# EAGLE design balancing_robot_h_bridges_power_sup (EAGLE 7.4.0)
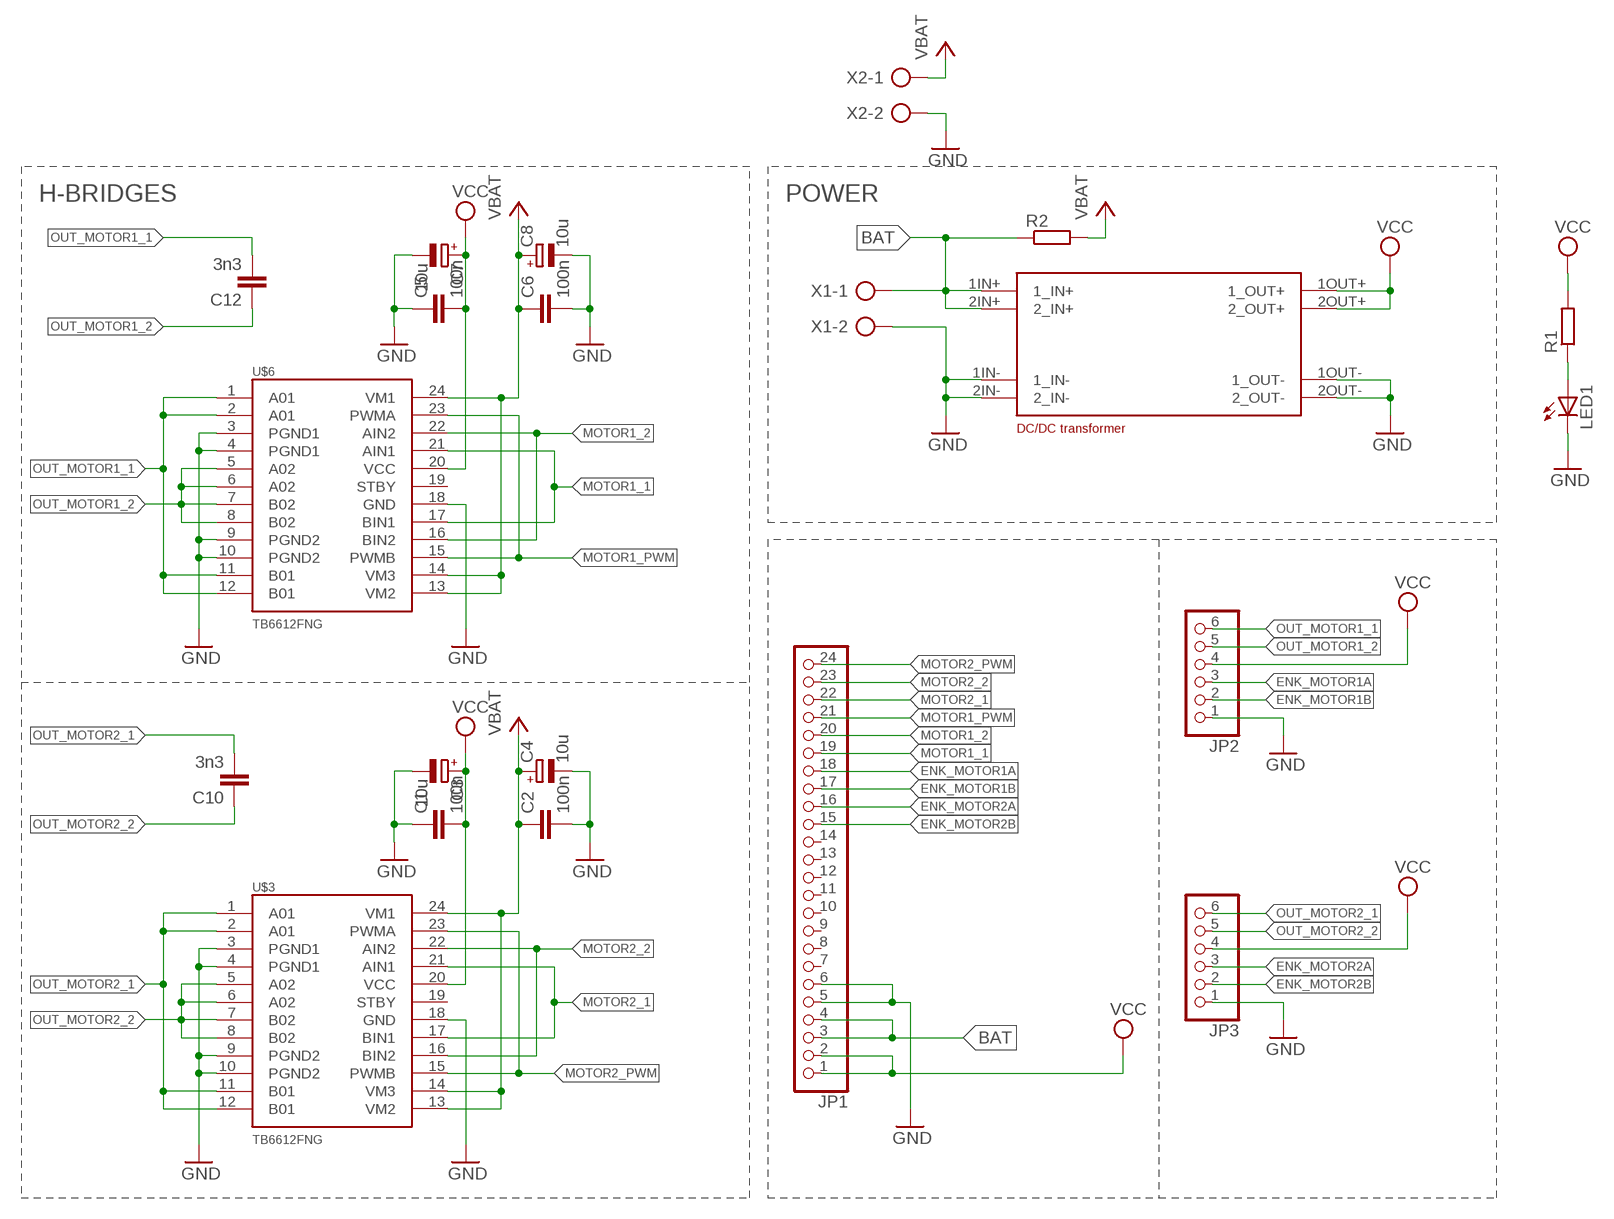
[diagram p0: schematic, sheet 1]

## Parts
C1  100n  C-EUC0603  [C0603]
C2  100n  C-EUC0603  [C0603]
C3  10u  CPOL-EU153CLV-0405  [153CLV-0405]
C4  10u  CPOL-EU153CLV-0405  [153CLV-0405]
C5  100n  C-EUC0603  [C0603]
C6  100n  C-EUC0603  [C0603]
C7  10u  CPOL-EU153CLV-0405  [153CLV-0405]
C8  10u  CPOL-EU153CLV-0405  [153CLV-0405]
C10  3n3  C-EUC0603  [C0603]
C12  3n3  C-EUC0603  [C0603]
JP1  PINHD-1X24  [1X24]
JP2  PINHD-1X6  [1X06]
JP3  PINHD-1X6  [1X06]
LED1  LEDCHIP-LED0603  [CHIP-LED0603]
R1  R-EU_R0603  [R0603]
R2  R-EU_R0805  [R0805]
U$3  TB6612FNG  [SSOP24]
U$4  TRANSFORMER  [TRANSFORMER]
U$6  TB6612FNG  [SSOP24]
X1  AK500/2  [AK500/2]
X2  AK500/2  [AK500/2]

## Nets
BAT: JP1.3 JP1.4 R2.1 U$4.1IN+(1_IN+) U$4.2IN+(2_IN+) X1.1
ENK_MOTOR1A: JP1.18 JP2.3
ENK_MOTOR1B: JP1.17 JP2.2
ENK_MOTOR2A: JP1.16 JP3.3
ENK_MOTOR2B: JP1.15 JP3.2
GND: C1.1 C2.2 C3.- C4.- C5.1 C6.2 C7.- C8.- JP1.5 JP1.6 JP2.1 JP3.1 LED1.C U$3.3(PGND1) U$3.4(PGND1) U$3.9(PGND2) U$3.10(PGND2) U$3.18(GND) U$4.1IN-(1_IN-) U$4.1OUT-(1_OUT-) U$4.2IN-(2_IN-) U$4.2OUT-(2_OUT-) U$6.3(PGND1) U$6.4(PGND1) U$6.9(PGND2) U$6.10(PGND2) U$6.18(GND) X1.2 X2.2
MOTOR1_1: JP1.19 U$6.17(BIN1) U$6.21(AIN1)
MOTOR1_2: JP1.20 U$6.16(BIN2) U$6.22(AIN2)
MOTOR1_PWM: JP1.21 U$6.15(PWMB) U$6.23(PWMA)
MOTOR2_1: JP1.22 U$3.17(BIN1) U$3.21(AIN1)
MOTOR2_2: JP1.23 U$3.16(BIN2) U$3.22(AIN2)
MOTOR2_PWM: JP1.24 U$3.15(PWMB) U$3.23(PWMA)
N$38: LED1.A R1.1
OUT_MOTOR1_1: C12.2 JP2.6 U$6.1(A01) U$6.2(A01) U$6.11(B01) U$6.12(B01)
OUT_MOTOR1_2: C12.1 JP2.5 U$6.5(A02) U$6.6(A02) U$6.7(B02) U$6.8(B02)
OUT_MOTOR2_1: C10.2 JP3.6 U$3.1(A01) U$3.2(A01) U$3.11(B01) U$3.12(B01)
OUT_MOTOR2_2: C10.1 JP3.5 U$3.5(A02) U$3.6(A02) U$3.7(B02) U$3.8(B02)
VCC: C1.2 C2.1 C3.+ C4.+ C5.2 C6.1 C7.+ C8.+ JP1.1 JP1.2 JP2.4 JP3.4 R1.2 R2.2 U$3.13(VM2) U$3.14(VM3) U$3.20(VCC) U$3.24(VM1) U$4.1OUT+(1_OUT+) U$4.2OUT+(2_OUT+) U$6.13(VM2) U$6.14(VM3) U$6.20(VCC) U$6.24(VM1) X2.1 ; supply symbol labelled VBAT
Unconnected: JP1.7 JP1.8 JP1.9 JP1.10 JP1.11 JP1.12 JP1.13 JP1.14 U$3.19(STBY) U$6.19(STBY)

## Notes on the sheet
- H-BRIDGES | POWER

## Library data of the parts
C1 C2 C5 C6 C10 C12 = rcl:C-EU: CAPACITOR, European symbol
C3 C4 C7 C8 = rcl:CPOL-EU: POLARIZED CAPACITOR, European symbol
JP1 = pinhead:PINHD-1X24: PIN HEADER
JP2 JP3 = pinhead:PINHD-1X6: PIN HEADER
LED1 = led:LED: LED OSRAM: - CHIPLED LG R971, LG N971, LY N971, LG Q971, LY Q971, LO R971, LY R971 LH N974, LH R974 LS Q976, LO Q976, LY Q976 LO Q996 - Hyper CHIPLED LW Q18S LB Q993, LB Q99A, LB R99A - SideLED LS A670, LO A670, LY A670, LG A670, LP A670 LB A673, LV A673, LT A673, LW A673 LH A674 LY A675 LS A676, LA A676, LO A676, LY A676, LW A676 LS A679, LY A679, LG A679 - Hyper Micro SIDELED® LS Y876, LA Y876, LO Y876, LY Y876 LT Y87S - SmartLED LW L88C, LW L88S LB L89C, LB L89S, LG L890 LS L89K, LO L89K, LY L89K LS L896, LA L896, LO L896, LY L896 - TOPLED LS T670, LO T670, LY T670, LG T670, LP T670 LSG T670, LSP T670, LSY T670, LOP T670, LYG T670 LG T671, LOG T671, LSG T671 LB T673, LV T673, LT T673, LW T673 LH T674 LS T676, LA T676, LO T676, LY T676, LB T676, LH T676, LSB T676, LW T676 LB T67C, LV T67C, LT T67C, LS T67K, LO T67K, LY T67K, LW E67C LS E67B, LA E67B, LO E67B, LY E67B, LB E67C, LV E67C, LT E67C LW T67C LS T679, LY T679, LG T679 LS T770, LO T770, LY T770, LG T770, LP T770 LB T773, LV T773, LT T773, LW T773 LH T774 LS E675, LA E675, LY E675, LS T675 LS T776, LA T776, LO T776, LY T776, LB T776 LHGB T686 LT T68C, LB T68C - Hyper Mini TOPLED® LB M676 - Mini TOPLED Santana® LG M470 LS M47K, LO M47K, LY M47K Source: http://www.osram.convergy.de LUXEON: - LUMILED® LXK2-PW12-R00, LXK2-PW12-S00, LXK2-PW14-U00, LXK2-PW14-V00 LXK2-PM12-R00, LXK2-PM12-S00, LXK2-PM14-U00 LXK2-PE12-Q00, LXK2-PE12-R00, LXK2-PE12-S00, LXK2-PE14-T00, LXK2-PE14-U00 LXK2-PB12-K00, LXK2-PB12-L00, LXK2-PB12-M00, LXK2-PB14-N00, LXK2-PB14-P00, LXK2-PB14-Q00 LXK2-PR12-L00, LXK2-PR12-M00, LXK2-PR14-Q00, LXK2-PR14-R00 LXK2-PD12-Q00, LXK2-PD12-R00, LXK2-PD12-S00 LXK2-PH12-R00, LXK2-PH12-S00 LXK2-PL12-P00, LXK2-PL12-Q00, LXK2-PL12-R00 Source: www.luxeon.com KINGBRIGHT: KA-3528ASYC Source: www.kingbright.com
R1 R2 = rcl:R-EU_: RESISTOR, European symbol
U$3 U$6 = SparkFun-PowerIC:TB6612FNG: Toshiba 1A dual motor driver IC-09363; PROD_ID: IC-09363
U$4 = DC_DC_transformer:TRANSFORMER
X1 X2 = con-ptr500:AK500/2: CONNECTOR; OC_FARNELL: unknown; OC_NEWARK: unknown

## Board
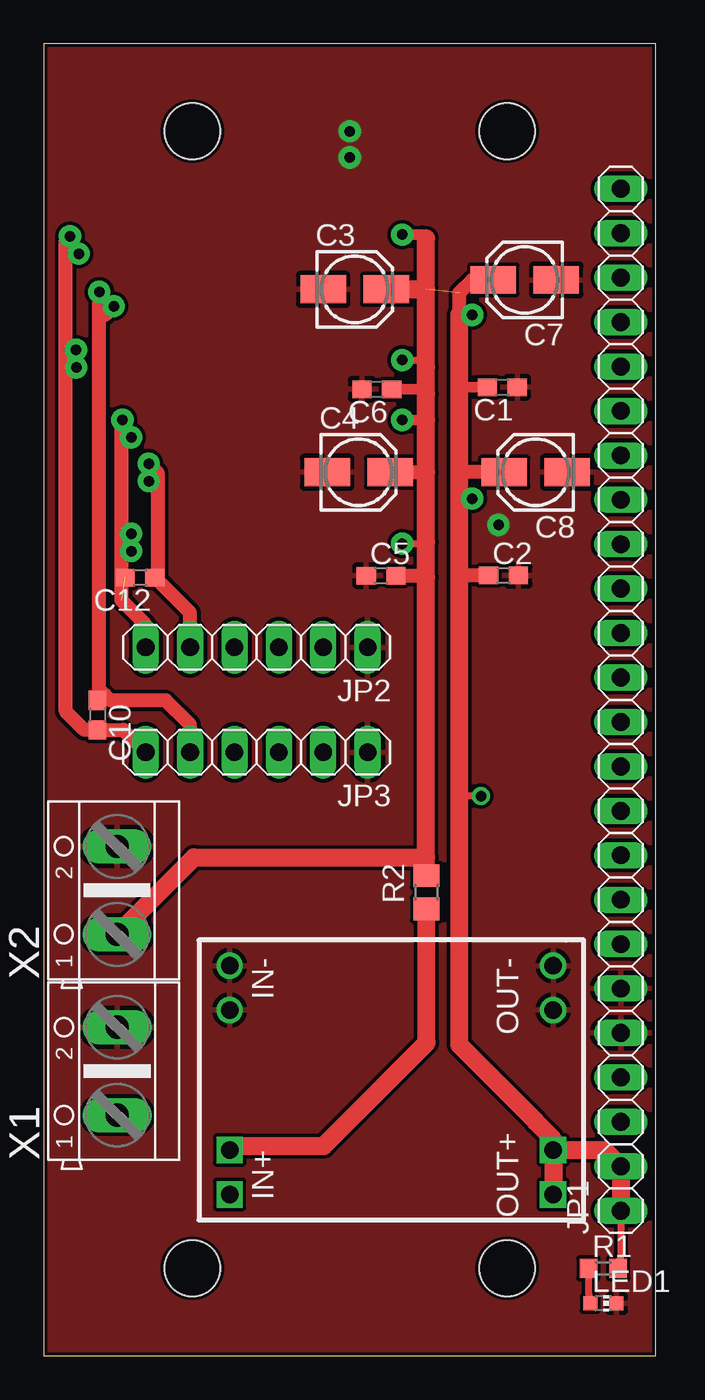
[diagram p1: board, top side]
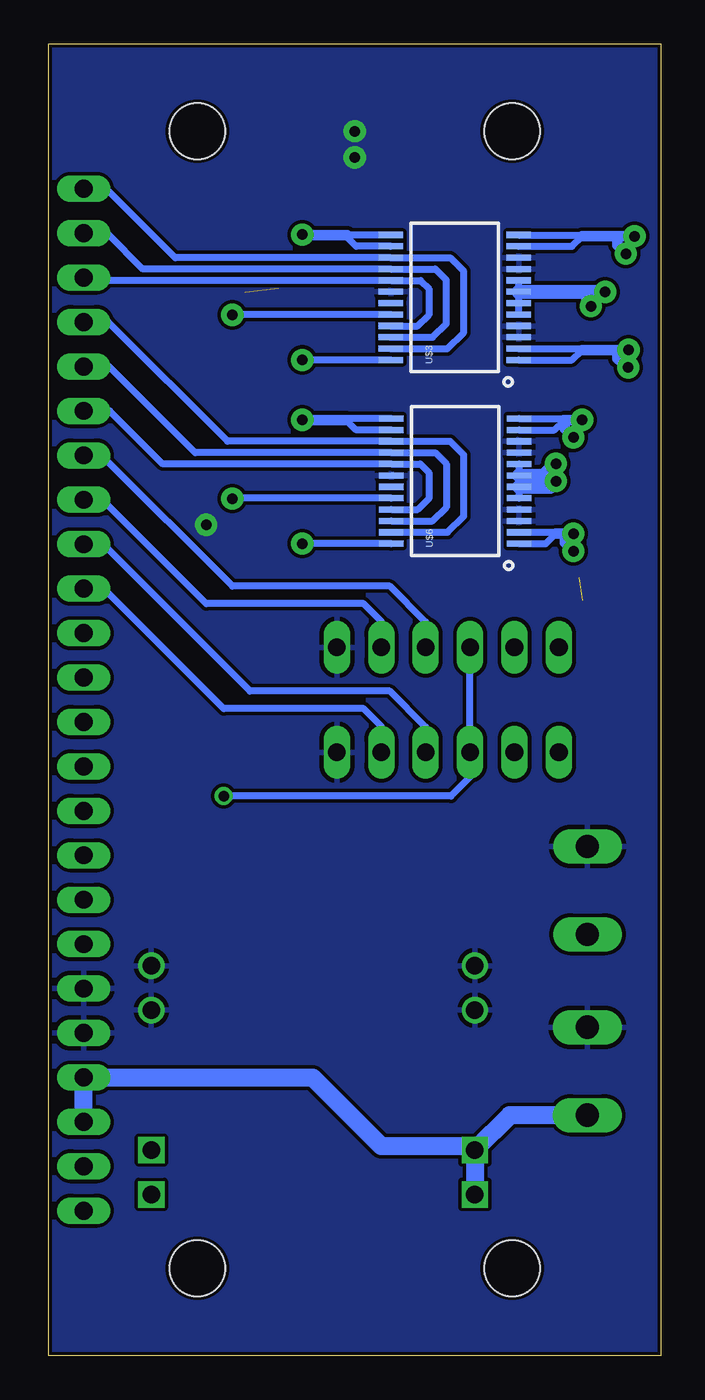
[diagram p2: board, bottom side, seen from below]

Size 35 x 75 mm. Coordinates in mm from the lower left corner, seen from the top.
Outline: 0,0 35,0 35,75 0,75 0,0
Copper layers (1*16): Top 0.035mm / dielectric 1.5mm / Bottom 0.035mm
Design rules "default *": minimum track width 10mil, minimum drill 0.5mm, track to track 8mil, track to pad 8mil, pad to pad 8mil, via to via 8mil, smd to smd 8mil, copper to edge 8mil, drill to drill 8mil, minimum pad ring 10mil, minimum via ring 8mil, stop-mask expansion 4mil, vias tented up to drill 0mil, thermal gap 10mil
Holes 3.2 mm at 8.5,5 26.5,5 8.5,70 26.5,70

### Footprints (pad centres in the part's own frame; a part is rotated, then mirrored left to right if it is on the bottom)
C0603 = smd 1.1 x 1: 1 -0.85,0; 2 0.85,0
153CLV-0405 = smd 2.6 x 1.6: + 1.8,0; - -1.8,0
1X24 = drill 1.016 long: 1 -29.21,0; 2 -26.67,0; 3 -24.13,0; 4 -21.59,0; 5 -19.05,0; 6 -16.51,0; 7 -13.97,0; 8 -11.43,0; 9 -8.89,0; 10 -6.35,0; 11 -3.81,0; 12 -1.27,0; 13 1.27,0; 14 3.81,0; 15 6.35,0; 16 8.89,0; 17 11.43,0; 18 13.97,0; 19 16.51,0; 20 19.05,0; 21 21.59,0; 22 24.13,0; 23 26.67,0; 24 29.21,0
1X06 = drill 1.016 long: 1 -6.35,0; 2 -3.81,0; 3 -1.27,0; 4 1.27,0; 5 3.81,0; 6 6.35,0
CHIP-LED0603 = smd 0.8 x 0.8: A 0,-0.75; C 0,0.75
R0603 = smd 1 x 1.1: 1 -0.85,0; 2 0.85,0
R0805 = smd 1.3 x 1.5: 1 -0.95,0; 2 0.95,0
SSOP24 = smd 0.348 x 1.397: 1 -3.575,-3.656; 2 -2.925,-3.656; 3 -2.275,-3.656; 4 -1.625,-3.656; 5 -0.975,-3.656; 6 -0.325,-3.656; 7 0.325,-3.656; 8 0.975,-3.656; 9 1.625,-3.656; 10 2.275,-3.656; 11 2.925,-3.656; 12 3.575,-3.656; 13 3.575,3.656; 14 2.925,3.656; 15 2.275,3.656; 16 1.625,3.656; 17 0.975,3.656; 18 0.325,3.656; 19 -0.325,3.656; 20 -0.975,3.656; 21 -1.625,3.656; 22 -2.275,3.656; 23 -2.925,3.656; 24 -3.575,3.656
TRANSFORMER = drill 1 square: 1IN+ 4,-9.25; 1OUT+ 4,9.25; 2IN+ 6.54,-9.25; 2OUT+ 6.54,9.25 | drill 1: 1IN- -6.54,-9.25; 1OUT- -6.54,9.25; 2IN- -4,-9.25; 2OUT- -4,9.25
AK500/2 = drill 1.321 long: 1 -2.515,0; 2 2.515,0

### Placement (x,y rotation side)
C1  26.23,55.36 180 top
C2  26.29,44.61 0 top
C3  17.78,60.96 0 top
C4  18,50.5 0 top
C5  19.29,44.6 0 top
C6  19.05,55.24 180 top
C7  27.5,61.5 180 top
C8  28.13,50.51 180 top
C10  3.08,36.62 270 top
C12  5.51,44.48 180 top
JP1  33,37.5 90 top
JP2  12.18,40.5 180 top
JP3  12.18,34.5 180 top
LED1  32,3 270 top
R1  32,5 0 top
R2  21.89,26.5 90 top
U$3  11.78,60.49 90 bottom
U$4  19.88,15.76 270 top
U$6  11.76,50 90 bottom
X1  4.2,16.27 90 top
X2  4.19,26.61 90 top

### Tracks (layer width: path | path; a pad name or v marks a point on that pad's centre or on a via)
BAT
  Top 1.016: U$4.1IN+ 10.87,12 16,12 21.89,17.89 R2.1
  Bottom 1.016: X1.1 8.63,13.76 U$4.1IN+ | U$4.1IN+ U$4.2IN+ | JP1.3 JP1.4 19.91,15.91 16,12 10.87,12 U$4.1IN+
ENK_MOTOR1A
  Bottom 0.406: JP2.3 13.45,41.95 15.5,44 24.5,44 31.97,51.47 JP1.18
ENK_MOTOR1B
  Bottom 0.406: JP2.2 15.98,41.98 17,43 26,43 31.93,48.93 JP1.17
ENK_MOTOR2A
  Bottom 0.406: JP3.3 13.45,35.95 15.5,38 23.5,38 31.89,46.39 JP1.16
ENK_MOTOR2B
  Bottom 0.406: JP3.2 15.98,35.98 17,37 25,37 31.85,43.85 JP1.15
GND  (via drill 0.6 pad 1.27)
  other vias: 17.5,70 17.5,68.5 26,47.5
  pour Top: -1.27,76.83 36.2,76.83 36.2,-3.17 -1.27,-3.17
  pour Bottom: -0.64,76.2 35.56,76.2 35.56,-2.54 -0.64,-2.54
MOTOR1_1
  Bottom 0.406: U$6.21 13.9,48.37 13.27,49 13.27,50.5 13.74,50.97 U$6.17 28.47,50.97 31.51,54.01 JP1.19
MOTOR1_2
  Bottom 0.406: U$6.22 13.05,47.72 12.27,48.5 12.27,51 12.89,51.62 U$6.16 26.62,51.62 31.55,56.55 JP1.20
MOTOR1_PWM
  Bottom 0.406: U$6.23 12.2,47.07 11.27,48 11.27,51.5 12.04,52.27 U$6.15 24.77,52.27 31.59,59.09 JP1.21
MOTOR2_1
  Bottom 0.406: U$3.21 13.9,58.87 13.27,59.5 13.27,61 13.74,61.47 U$3.17 32.84,61.47 JP1.22
MOTOR2_2
  Bottom 0.406: U$3.22 13.05,58.22 12.27,59 12.27,61.5 12.89,62.12 U$3.16 29.62,62.12 31.67,64.17 JP1.23
MOTOR2_PWM
  Bottom 0.406: U$3.23 12.2,57.57 11.27,58.5 11.27,62 12.04,62.77 U$3.15 27.77,62.77 28,63 28.25,63.25 31.71,66.71 JP1.24
N$38
  Top 0.406: R1.1 31.15,3.6 LED1.A
OUT_MOTOR1_1  (via drill 0.6 pad 1.27)  (1 unrouted)
  Top 0.61: v5,47 4.45,47 | v5,46 4.5,46 | v5,52.5 4.5,52.5
  Top 0.813: JP2.6 5.83,41.8 4.45,43.18 4.45,47 4.45,53.45 v4.5,53.5
  Bottom 0.406: U$6.12 5.57,53.57 5.5,53.5 6.08,52.92 U$6.11 | U$6.2 6.07,47.07 6,47 6.58,46.42 U$6.1
  Bottom 0.61: v4.5,53.5 5.5,53.5 5.5,53 v5,52.5 | 6,47 5.5,47 | 5.5,47 v5,47 | 5.5,47 5.5,46.5 v5,46
OUT_MOTOR1_2  (via drill 0.6 pad 1.27)
  Top 0.813: JP2.5 8.37,42.48 C12.1 6.5,44.62 6.5,49.5 | v6,50 6.5,49.5 | v6,51 6.5,50.5 6.5,49.5
  Bottom 0.406: U$6.8 U$6.7 U$6.6 U$6.5
  Bottom 0.813: U$6.6 6.33,49.67 v6,50 | U$6.7 6.68,50.32 v6,51
OUT_MOTOR2_1  (via drill 0.6 pad 1.27)
  Top 0.61: v1.84,57.5 1.27,57.5 | v1.86,56.5 1.5,56.5 | v2,63 1.5,63
  Top 0.813: JP3.6 4.55,35.77 C10.2 2.33,35.77 1.27,36.83 1.27,57.5 1.27,63.77 v1.5,64
  Bottom 0.406: U$3.12 4.57,64.07 4.5,64 5.08,63.42 U$3.11 | U$3.1 5.08,56.92 4.5,57.5 4.57,57.57 U$3.2
  Bottom 0.61: 4.5,64 2.5,64 | 2.5,64 v1.5,64 | 4.5,57.5 2.5,57.5 | 2.5,57.5 v1.84,57.5 | 2.5,57.5 2.5,57 v1.86,56.5 | 2.5,64 2.5,63.5 v2,63
OUT_MOTOR2_2  (via drill 0.6 pad 1.27)
  Top 0.813: JP3.5 8.37,36.09 6.99,37.47 3.81,37.47 3.49,37.78 | C10.1 3.19,37.48 3.49,37.78 | 3.49,37.78 3.17,38.1 3.17,60.23 3.18,60.23 v3.18,60.82 | v4,60 3.5,59.5
  Bottom 0.406: U$3.5 U$3.6 U$3.7 U$3.8
  Bottom 0.813: U$3.7 4.17,60.82 | 4.17,60.82 v3.18,60.82 | 4.17,60.82 4.17,60.17 v4,60
VCC  (via drill 0.6, 0.6 pad 1.27)  (1 unrouted)
  Top 0.305: 21.5,53.5 21.86,53.5
  Top 0.406: v20.5,46.43 21.79,46.43 21.86,46.5 | v20.5,56.92 21.86,56.92 21.86,56.5 | JP1.1 33,5.85 R1.2 | v24.5,59.5 23.77,59.5 | v24.5,49 23.77,49 | v25,32 23.77,32
  Top 0.61: v20.5,53.5 21.5,53.5 | v20.5,64.09 21.63,64.09 21.86,63.86 | C1.2 23.91,55.36 23.77,55.5 | C6.1 21.61,55.24 21.86,55
  Top 0.813: C4.+ 21.86,50.5 | C8.+ 23.77,50.51 23.77,50 | 23.77,59.5 23.77,60.77 24.5,61.5 C7.+ | C2.1 23.77,44.61 23.77,44.5 | C5.2 21.86,44.6 21.86,44.5
  Top 1.016: U$4.1OUT+ U$4.2OUT+ | 23.77,59.5 23.77,55.5 23.77,50 23.77,49 23.77,44.5 23.77,32 23.77,17.78 28.14,13.41 28.14,13.37 29.13,12.37 U$4.1OUT+ | 21.86,28.5 21.86,27.48 R2.2 | 21.86,28.5 21.86,44.5 21.86,46.5 21.86,50.5 21.86,53.5 21.86,55 21.86,56.5 21.86,61 | 21.86,61 21.86,63.86 21.87,63.86 | U$4.1OUT+ 32.07,11.76 JP1.2 JP1.1 | C3.+ 21.82,60.96 21.86,61 | X2.1 8.6,28.5 21.86,28.5
  Bottom 0.406: U$6.13 19.2,53.57 18,53.5 17.42,52.92 U$6.14 | U$6.24 v20.49,46.42 v20.5,46.43 | U$3.14 17.42,63.42 18,64 17.93,64.07 U$3.13 | U$3.24 v20.5,56.92 | U$3.20 24.48,59.52 v24.5,59.5 | U$6.20 24.48,49.02 v24.5,49 | JP2.4 JP3.4 10.9,33.09 12,32 v25,32
  Bottom 0.61: 18,53.5 v20.5,53.5 | 17.93,64.07 20.49,64.07 v20.5,64.09